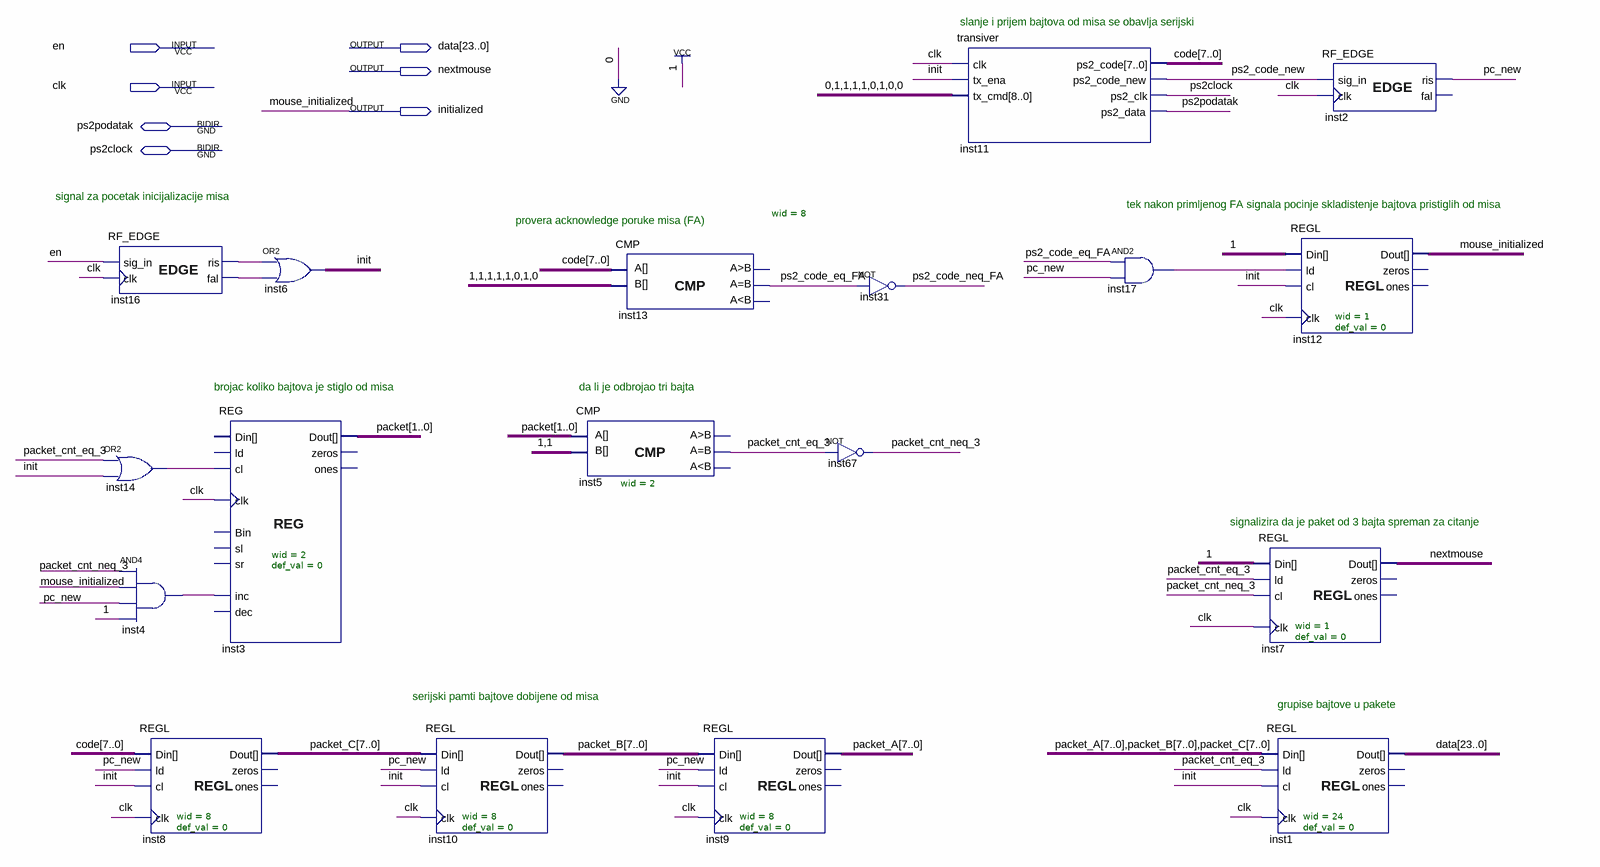
[diagram p0: schematic sheet]
// Quartus schematic mis.bdf as structural Verilog: 18 symbols, 7 pins
module mis (
  input  en,
  input  clk,
  inout  ps2podatak,
  inout  ps2clock,
  output [23:0] data,
  output nextmouse,
  output initialized
);

  wire init, inst4_out, inst14_out, inst16_fal, inst16_ris, inst17_out, packet_cnt_eq_3, packet_cnt_neq_3,
       pc_new, ps2_code_eq_FA, ps2_code_neq_FA, ps2_code_new;
  wire [1:0] packet;
  wire [7:0] code, packet_A, packet_B, packet_C;

  RF_EDGE inst16 (.sig_in(en), .clk(clk), .ris(inst16_ris), .fal(inst16_fal));
  or inst14 (inst14_out, packet_cnt_eq_3, init);
  and inst4 (inst4_out, packet_cnt_neq_3, initialized, pc_new, 1'b1);
  REGL #(.wid(8), .def_val(0)) inst8 (
    .Din(code), .ld(pc_new), .cl(init), .clk(clk), .Dout(packet_C));  // open: zeros, ones
  REG #(.wid(2), .def_val(0)) inst3 (
    .cl(inst14_out), .clk(clk), .inc(inst4_out), .Dout(packet));  // open: ld, Bin, sl, sr, dec, Din, zeros, ones
  or inst6 (init, inst16_ris, inst16_fal);
  REGL #(.wid(8), .def_val(0)) inst10 (
    .Din(packet_C), .ld(pc_new), .cl(init), .clk(clk), .Dout(packet_B));  // open: zeros, ones
  CMP #(.wid(2)) inst5 (.A(packet), .B(2'b11), .eq(packet_cnt_eq_3));  // open: gr, ls
  CMP #(.wid(8)) inst13 (.A(code), .B(8'b11111010), .eq(ps2_code_eq_FA));  // open: gr, ls
  REGL #(.wid(8), .def_val(0)) inst9 (
    .Din(packet_B), .ld(pc_new), .cl(init), .clk(clk), .Dout(packet_A));  // open: zeros, ones
  not inst67 (packet_cnt_neq_3, packet_cnt_eq_3);
  not inst31 (ps2_code_neq_FA, ps2_code_eq_FA);
  transiver inst11 (
    .clk(clk), .tx_ena(init), .tx_cmd(9'b011110100), .ps2_code(code), .ps2_code_new(ps2_code_new),
    .ps2_clk(ps2clock), .ps2_data(ps2podatak));
  and inst17 (inst17_out, ps2_code_eq_FA, pc_new);
  REGL #(.wid(1), .def_val(0)) inst7 (
    .Din(1'b1), .ld(packet_cnt_eq_3), .cl(packet_cnt_neq_3), .clk(clk), .Dout(nextmouse));  // open: zeros, ones
  REGL #(.wid(24), .def_val(0)) inst1 (
    .Din({packet_A, packet_B, packet_C}), .ld(packet_cnt_eq_3), .cl(init), .clk(clk), .Dout(data));  // open: zeros, ones
  RF_EDGE inst2 (.sig_in(ps2_code_new), .clk(clk), .ris(pc_new));  // open: fal
  REGL #(.wid(1), .def_val(0)) inst12 (
    .Din(1'b1), .ld(inst17_out), .cl(init), .clk(clk), .Dout(initialized));  // open: zeros, ones

  // Other names for the same wires on the sheet: mouse_initialized = initialized

  // Notes on the sheet:
  //   slanje i prijem bajtova od misa se obavlja serijski
  //   signal za pocetak inicijalizacije misa
  //   tek nakon primljenog FA signala pocinje skladistenje bajtova pristiglih od misa        
  //   provera acknowledge poruke misa (FA)
  //   brojac koliko bajtova je stiglo od misa
  //   da li je odbrojao tri bajta
  //   signalizira da je paket od 3 bajta spreman za citanje
  //   serijski pamti bajtove dobijene od misa
  //   grupise bajtove u pakete
endmodule
